# Altium schematic sheet Sheet_1_2022-11-16.schdoc
size 255 x 91 mm
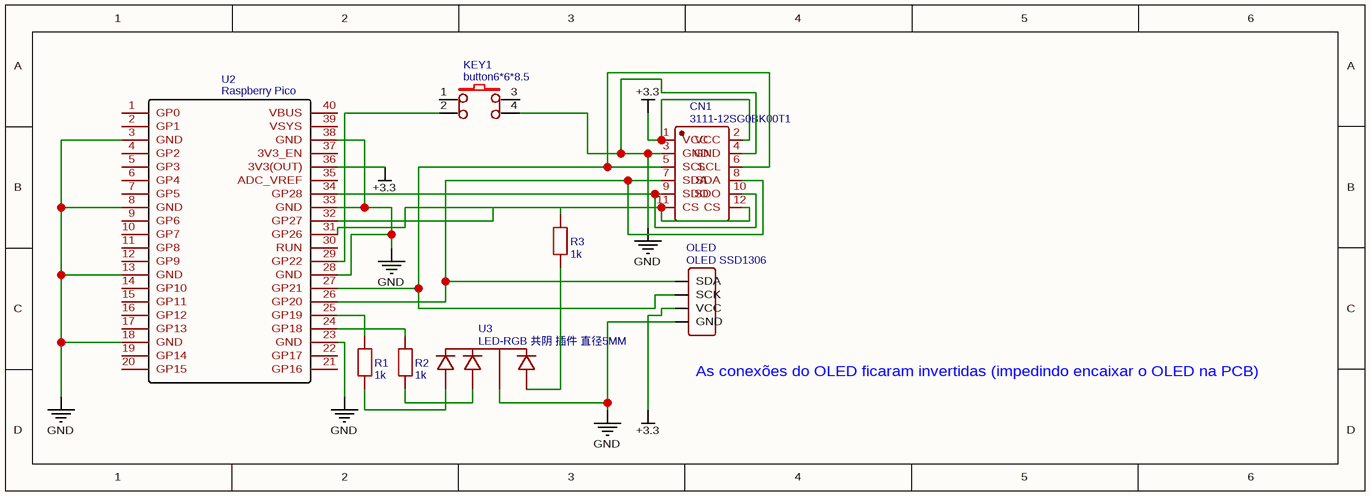
[diagram p0: Sheet_1_2022-11-16.schdoc]

## Parts
CN1  3111-12SG0BK00T1  [IDC-TH_12P-P2.00-V-R2-C6-S2.00]
KEY1  button6*6*8.5  [KEY-TH_4P-L6.0-W6.0-P4.50]
OLED  OLED SSD1306  [HDR-F-2.54_1X4]
R1  1k  [R_AXIAL-0.3]
R2  1k  [R_AXIAL-0.3]
R3  1k  [R_AXIAL-0.3]
U2  Raspberry Pico  [RASPBERRYPICO]
U3  LED-RGB 共阴 插件 直径5MM  [LED-TH_4P-BD5.8-P1.30]

## Nets
+3.3: CN1.1(VCC) CN1.2(VCC) OLED.3(VCC) U2.36(3V3(OUT))
GND: CN1.3(GND) CN1.4(GND) KEY1.4 OLED.4(GND) U2.3(GND) U2.8(GND) U2.13(GND) U2.18(GND) U2.23(GND) U2.28(GND) U2.33(GND) U2.38(GND) U3.2(-)
NetCN1_5: CN1.5(SCL) CN1.6(SCL) OLED.2(SCK) U2.27(GP21)
NetCN1_7: CN1.7(SDA) CN1.8(SDA) OLED.1(SDA) U2.26(GP20)
NetCN1_9: CN1.9(SDO) CN1.10(SDO) U2.34(GP28)
NetCN1_11: CN1.11(CS) CN1.12(CS) R3.2 U2.31(GP26) U2.32(GP27)
NetKEY1_2: KEY1.2 U2.29(GP22)
NetR1_1: R1.1 U3.4
NetR1_2: R1.2 U2.25(GP19)
NetR2_1: R2.1 U3.3
NetR2_2: R2.2 U2.24(GP18)
NetR3_1: R3.1 U3.1

Not connected (* = marked no-connect by the designer): KEY1 1 3; U2 1(GP0) 2(GP1) 4(GP2) 5(GP3) 6(GP4) 7(GP5) 9(GP6) 10(GP7) 11(GP8) 12(GP9) 14(GP10) 15(GP11) 16(GP12) 17(GP13) 19(GP14) 20(GP15) 21(GP16) 22(GP17) 30(RUN) 35(ADC_VREF) 37(3V3_EN) 39(VSYS) 40(VBUS)

## Notes on the sheet
- (near OLED) As conexões do OLED ficaram invertidas (impedindo encaixar o OLED na PCB)

## Library data of the parts
CN1 = 3111-12SG0BK00T1: BOM_Manufacturer: Wcon(维峰电子); Contributor: LCSC; BOM_Supplier: LCSC; BOM_Supplier Part: C783796; BOM_Manufacturer Part: 3111-12SG0BK00T1; BOM_JLCPCB Part Class: Extended Part; spicePre: C; spiceSymbolName: 3111-12SG0BK00T1
KEY1 = button6*6*8.5: BOM_Manufacturer: ReliaPro; BOM_Supplier Part: C59980; BOM_Supplier: LCSC; BOM_Manufacturer Part: button6*6*8.5; spicePre: K; spiceSymbolName: button6*6*8.5
OLED = OLED SSD1306: Contributor: LCEDA_Lib; BOM_Supplier Part: C225501; BOM_Supplier: LCSC; spicePre: H; spiceSymbolName: HDR-F-2.54_1x4
R1-R3 = 1k: nameAlias: Value(Ω); Contributor: LCEDA_Lib; spicePre: R; spiceSymbolName: R_AXIAL-0.3_EU
U2 = Raspberry Pico: BOM_Manufacturer Part: SC0915; Contributor: ibrahim.bostanci; BOM_Manufacturer: RaspberryPi; BOM_Supplier: Samm Market; BOM_Supplier Part: SC0915; link: https://www.raspberrypi.com/products/raspberry-pi-pico/; spicePre: U; spiceSymbolName: Raspberry Pico
U3 = LED-RGB 共阴 插件 直径5MM: BOM_Manufacturer: null; Contributor: lcsc; BOM_Supplier: LCSC; BOM_Supplier Part: C9900015469; BOM_Manufacturer Part: LED-RGB 共阴 插件 直径5mm; BOM_JLCPCB Part Class: Extended Part; spicePre: U; spiceSymbolName: LED-RGB 共阴 插件 直径5MM